# Altium schematic sheet ATMEGA.SchDoc
size A4; Organization: Altium Limited; Address1: L3, 12a Rodborough Rd; Address2: Frenchs Forest; Address3: NSW; Address4: Australia 2086
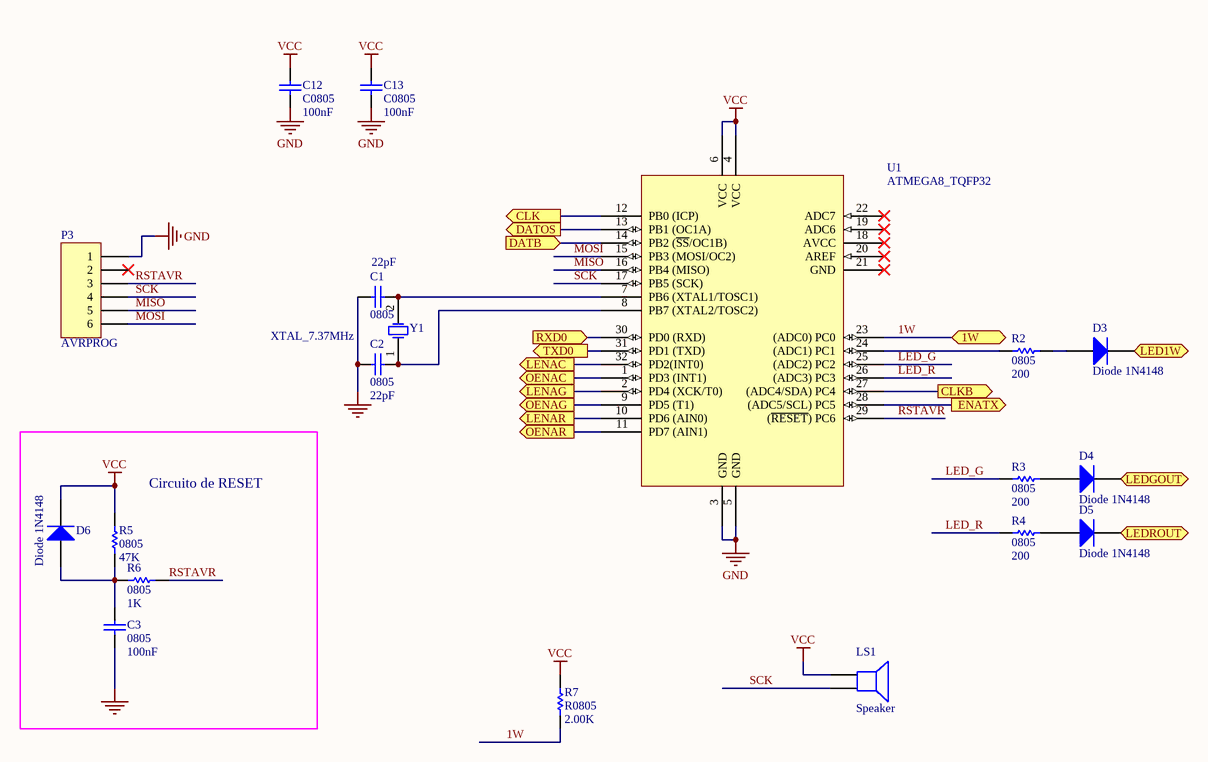
[diagram p0: ATMEGA.SchDoc]

## Parts
C1  0805  value 22pF  [C0805C]
C2  0805  value 22pF  [C0805C]
C3  0805  value 100nF  [C0805C]
C12  C0805  value 100nF  [C0805C]
C13  C0805  value 100nF  [C0805C]
D3  Diode 1N4148  [1N4148SMD]
D4  Diode 1N4148  [1N4148SMD]
D5  Diode 1N4148  [1N4148SMD]
D6  Diode 1N4148  [1N4148SMD]
LS1  Speaker  [PIN2]
P3  AVRPROG  [HDR1X6]
R2  0805  value 200  [R0805]
R3  0805  value 200  [R0805]
R4  0805  value 200  [R0805]
R5  0805  value 47K  [R0805]
R6  0805  value 1K  [R0805]
R7  R0805  value 2.00K  [R0805]
U1  ATMEGA8_TQFP32  [TQFP-32]
Y1  XTAL_7.37MHz  [CRYSTALSMD]

## Blocks framed on the sheet
Circuito de RESET: C3 D6 R5 R6

## Ports
1W (bidir), CLK (out), CLKB (out), DATB (in), DATOS (out), ENATX (out), LED1W (out), LEDGOUT (out), LEDROUT (out), LENAC (out), LENAG (out), LENAR (out), OENAC (out), OENAG (out), OENAR (out), RXD0 (in), TXD0 (out)

## Nets
GND: C1.1 C2.1 C3.1 C12.1 C13.1 P3.1 U1.3(GND) U1.5(GND)
VCC: C12.2 C13.2 D6.2(K) LS1.1 R5.2 R7.2 U1.4(VCC) U1.6(VCC)
1W: R7.1 U1.23((ADC0)_PC0) ; port 1W
CLK: U1.12(PB0_(ICP)) ; port CLK
CLKB: U1.27((ADC4/SDA)_PC4) ; port CLKB
DATB: U1.14(PB2_(~{SS}/OC1B)) ; port DATB
DATOS: U1.13(PB1_(OC1A)) ; port DATOS
ENATX: U1.28((ADC5/SCL)_PC5) ; port ENATX
LED1W: D3.2(K) ; port LED1W
LED_G: R3.1 U1.25((ADC2)_PC2)
LED_R: R4.1 U1.26((ADC3)_PC3)
LEDGOUT: D4.2(K) ; port LEDGOUT
LEDROUT: D5.2(K) ; port LEDROUT
LENAC: U1.32(PD2(INT0)) ; port LENAC
LENAG: U1.2(PD4_(XCK/T0)) ; port LENAG
LENAR: U1.10(PD6_(AIN0)) ; port LENAR
MISO: P3.5 U1.16(PB4_(MISO))
MOSI: P3.6 U1.15(PB3_(MOSI/OC2))
OENAC: U1.1(PD3_(INT1)) ; port OENAC
OENAG: U1.9(PD5_(T1)) ; port OENAG
OENAR: U1.11(PD7_(AIN1)) ; port OENAR
RSTAVR: P3.3 R6.2 U1.29((~{RESET})_PC6)
RXD0: U1.30(PD0_(RXD)) ; port RXD0
SCK: LS1.2 P3.4 U1.17(PB5_(SCK))
TXD0: U1.31(PD1_(TXD)) ; port TXD0
NetC1_2: C1.2 U1.7(PB6_(XTAL1/TOSC1)) Y1.2(OSC2)
NetC2_2: C2.2 U1.8(PB7_(XTAL2/TOSC2)) Y1.1(OSC1)
NetC3_2: C3.2 D6.1(A) R5.1 R6.1
NetD3_1: D3.1(A) R2.2
NetD4_1: D4.1(A) R3.2
NetD5_1: D5.1(A) R4.2
NetR2_1: R2.1 U1.24((ADC1)_PC1)

Not connected (* = marked no-connect by the designer): P3 2*; U1 18(AVCC)* 19(ADC6)* 20(AREF)* 21(GND)* 22(ADC7)*

## Notes on the sheet
- Title
- Size:
- Date:
- A4
- Number:
- Time:
- Revision:
- Sheet
- of
- File:

## Library data of the parts
C1 C2 = Cap 0805 22pF: Cap 22pF; Part: 399-1113-1; Proveedor: Digikey; Published: 8-Jun-2000; LatestRevisionDate: 17-Jul-2002; LatestRevisionNote: Re-released for DXP Platform.; PackageReference: C1206; Publisher: Altium Limited; Price: 0.05
C3 = Cap 0805: Cap 100nF 25V X7R; Part: 399-1170-1-ND; Proveedor: Digikey; Published: 8-Jun-2000; LatestRevisionDate: 17-Jul-2002; LatestRevisionNote: Re-released for DXP Platform.; PackageReference: C1206; Publisher: Altium Limited; Price: 0.05
C12 C13 = Cap 0805 100nF: Cap 100nF 25V X7R; Part: 399-1170-1-ND; Proveedor: Digikey; Published: 8-Jun-2000; LatestRevisionDate: 17-Jul-2002; LatestRevisionNote: Re-released for DXP Platform.; PackageReference: C1206; Publisher: Altium Limited; Price: 0.10
D3-D6 = Diode 1N4148: 1N4148; Part: 1N4148WTPMSCT; Proveedor: Digikey; Published: 8-Jun-2000; LatestRevisionDate: 17-Jul-2002; LatestRevisionNote: Re-released for DXP Platform.; PackageVersion: Sep-1996; PackageReference: SMC; Publisher: Altium Limited; Code_JEDEC: DO-214-AB
  D3-D5: Price: 0.14
  D6: Price: 0.202
LS1 = Speaker: Loudspeaker; Published: 24-Mar-1999; LatestRevisionDate: 17-Jul-2002; LatestRevisionNote: Re-released for DXP Platform.; PackageReference: PIN2; Publisher: Altium Limited
P3 = Header 6: Header, 6-Pin; LatestRevisionDate: 17-Jul-2002; LatestRevisionNote: Re-released for DXP Platform.; Publisher: Altium Limited
R2-R4 = Res 0805 200: Semiconductor Resistor; Part: 541-200ACT; Proveedor: Digikey; Published: 8-Jun-2000; LatestRevisionDate: 17-Jul-2002; LatestRevisionNote: Re-released for DXP Platform.; PackageReference: AXIAL-0.5; Publisher: Altium Limited; Price: 0.077
R5 = Res 0805 47K: Semiconductor Resistor; Part: 541-47KACT; Proveedor: Digikey; Published: 8-Jun-2000; LatestRevisionDate: 17-Jul-2002; LatestRevisionNote: Re-released for DXP Platform.; PackageReference: AXIAL-0.5; Publisher: Altium Limited; Price: 0.077
R6 = Res 0805 1K: Semiconductor Resistor; Part: 541-1.0KACT; Proveedor: Digikey; Published: 8-Jun-2000; LatestRevisionDate: 17-Jul-2002; LatestRevisionNote: Re-released for DXP Platform.; PackageReference: AXIAL-0.5; Publisher: Altium Limited; Price: 0.077
R7 = Res 0805 2.00K: Semiconductor Resistor; Part: 311-2.0KARCT-ND; Proveedor: Digikey; Published: 8-Jun-2000; LatestRevisionDate: 17-Jul-2002; LatestRevisionNote: Re-released for DXP Platform.; PackageReference: AXIAL-0.5; Publisher: Altium Limited; Price: 0.1
U1 = ATMEGA8_TQFP32: Atmel Microcontroller - Library created by carel..  <www.mpfreezone.com>
Y1 = XTAL_7.37MHz: CRYSTAL 7.3728MHZ 18PF SMD; Part: 535-9088-1-ND; Proveedor: Digikey; Published: 8-Jun-2000; LatestRevisionDate: 17-Jul-2002; LatestRevisionNote: Re-released for DXP Platform.; PackageReference: R38; Publisher: Altium Limited; Price: 0.56